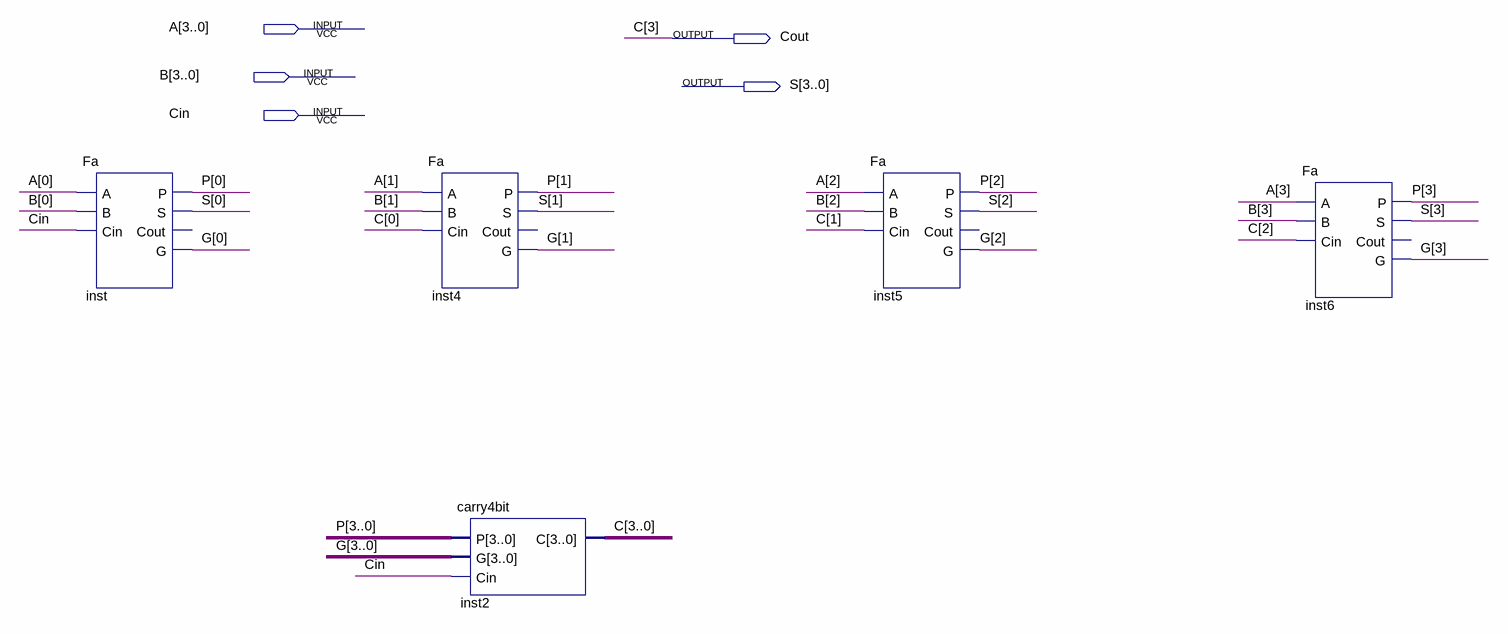
[diagram p0: schematic sheet]
// Quartus schematic CLA.bdf as structural Verilog: 5 symbols, 5 pins
module CLA (
  input  [3:0] A,
  input  [3:0] B,
  input  Cin,
  output Cout,
  output [3:0] S
);

  wire [2:0] C;
  wire [3:0] G, P;

  Fa inst (.A(A[0]), .B(B[0]), .Cin(Cin), .P(P[0]), .S(S[0]), .G(G[0]));  // open: Cout
  Fa inst4 (.A(A[1]), .B(B[1]), .Cin(C[0]), .P(P[1]), .S(S[1]), .G(G[1]));  // open: Cout
  carry4bit inst2 (.P(P), .G(G), .Cin(Cin), .C({Cout, C}));
  Fa inst5 (.A(A[2]), .B(B[2]), .Cin(C[1]), .P(P[2]), .S(S[2]), .G(G[2]));  // open: Cout
  Fa inst6 (.A(A[3]), .B(B[3]), .Cin(C[2]), .P(P[3]), .S(S[3]), .G(G[3]));  // open: Cout

  // Other names for the same wires on the sheet: C[3] = Cout
endmodule
